# Altium schematic sheet 11.MIPI_CSI_RX.SchDoc: CM3 IO
size 297 x 209 mm; Page Create Date: March  8, 1995; Page Number: 11; Page Size: A4; Comment: radxa_1010; Page Count: 20; RevCode: 1.36; Doc: MIPI_CSI_RX; DsnPath: D:\WMS\黄工\[RC119]CM3_IO_V1.36\对外资料\radxa_cm3_io_board_v1360.DSN; SchematicName: CM3_IO V1.36; PageName: 11.MIPI_CSI_RX; PageSize: A4; TopSchematic: True
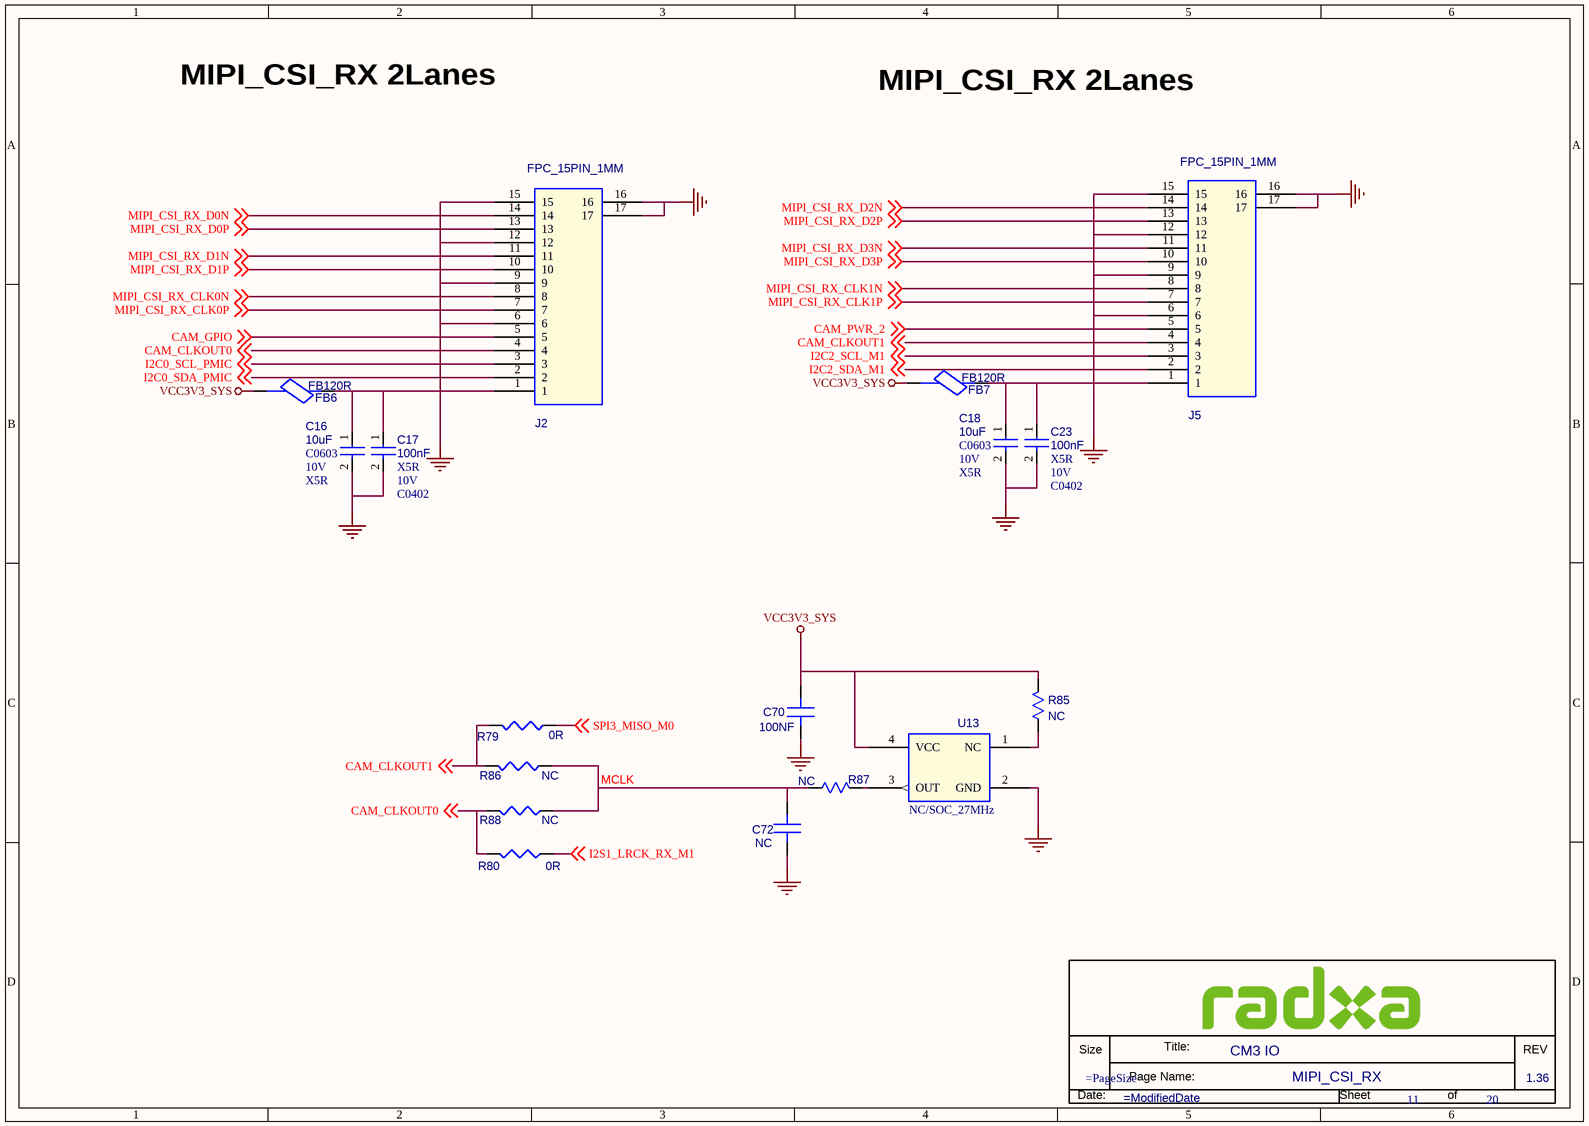
[diagram p0: 11.MIPI_CSI_RX.SchDoc]

## Parts
*  Doc: MIPI_CSI_RX  RevCode: 1.36  Title: CM3 IO  Page Number: 11  Page Count: 20  (hidden comment: radxa_1010)  (graphical)
C16  10uF  Voltage: 10V  Dielectric: X5R  [C0603]
C17  100nF  Voltage: 10V  Dielectric: X5R  [C0402]
C18  10uF  Voltage: 10V  Dielectric: X5R  [C0603]
C23  100nF  Voltage: 10V  Dielectric: X5R  [C0402]
C70  100NF  [C0402]
C72  NC  [C0402]
FB6  FB120R  [R0402]
FB7  FB120R  [R0402]
J2  FPC_15PIN_1MM  [FPC_15PIN_1MM]
J5  FPC_15PIN_1MM  [FPC_15PIN_1MM]
R79  0R  [R0402]
R80  0R  [R0402]
R85  NC  [R0402]
R86  NC  [R0402]
R87  NC  [R0402]
R88  NC  [R0402]
U13  NC/SOC_27MHz  [CRY4_3R20X2R50X0R80]

## Nets
GND: C16.2 C17.2 C18.2 C23.2 C70.2 C72.2 J2.6 J2.9 J2.12 J2.15 J2.16 J2.17 J5.6 J5.9 J5.12 J5.15 J5.16 J5.17 U13.2(GND)
VCC3V3_SYS: C70.1 FB6.1 FB7.1 R85.2 U13.4(VCC)
CAM_CLKOUT0: J2.4 R80.1 R88.2 ; off-sheet CAM_CLKOUT0
CAM_CLKOUT1: J5.4 R79.1 R86.2 ; off-sheet CAM_CLKOUT1
CAM_GPIO: J2.5 ; off-sheet CAM_GPIO
CAM_PWR_2: J5.5 ; off-sheet CAM_PWR_2
I2C0_SCL_PMIC: J2.3 ; off-sheet I2C0_SCL_PMIC
I2C0_SDA_PMIC: J2.2 ; off-sheet I2C0_SDA_PMIC
I2C2_SCL_M1: J5.3 ; off-sheet I2C2_SCL_M1
I2C2_SDA_M1: J5.2 ; off-sheet I2C2_SDA_M1
I2S1_LRCK_RX_M1: R80.2 ; off-sheet I2S1_LRCK_RX_M1
MCLK: C72.1 R86.1 R87.2 R88.1
MIPI_CSI_RX_CLK0N: J2.8 ; off-sheet MIPI_CSI_RX_CLK0N
MIPI_CSI_RX_CLK0P: J2.7 ; off-sheet MIPI_CSI_RX_CLK0P
MIPI_CSI_RX_CLK1N: J5.8 ; off-sheet MIPI_CSI_RX_CLK1N
MIPI_CSI_RX_CLK1P: J5.7 ; off-sheet MIPI_CSI_RX_CLK1P
MIPI_CSI_RX_D0N: J2.14 ; off-sheet MIPI_CSI_RX_D0N
MIPI_CSI_RX_D0P: J2.13 ; off-sheet MIPI_CSI_RX_D0P
MIPI_CSI_RX_D1N: J2.11 ; off-sheet MIPI_CSI_RX_D1N
MIPI_CSI_RX_D1P: J2.10 ; off-sheet MIPI_CSI_RX_D1P
MIPI_CSI_RX_D2N: J5.14 ; off-sheet MIPI_CSI_RX_D2N
MIPI_CSI_RX_D2P: J5.13 ; off-sheet MIPI_CSI_RX_D2P
MIPI_CSI_RX_D3N: J5.11 ; off-sheet MIPI_CSI_RX_D3N
MIPI_CSI_RX_D3P: J5.10 ; off-sheet MIPI_CSI_RX_D3P
SPI3_MISO_M0: R79.2 ; off-sheet SPI3_MISO_M0
NetC16_1: C16.1 C17.1 FB6.2 J2.1
NetC18_1: C18.1 C23.1 FB7.2 J5.1
NetR85_1: R85.1 U13.1(NC)
NetR87_1: R87.1 U13.3(OUT)

## Notes on the sheet
- MIPI_CSI_RX 2Lanes
- (in symbol radxa_1010) Title:; Size; REV; Page Name:; Date:; Sheet; of

## Library data of the parts
C16 = CAP NP: cap,10.00uF,+/-10%,10V,X5R,C0603; Part Reference: C16; Manufacturer PN: C1608X5R1A106K080AC; Manufacturer: TDK; Tolerance: 10%; Priority: A; PCB Footprint: C0603; Value: 10uF; Created by: JJJ; Part Type: C0603; RK PN: C1608X5R1A106K080AC
C17 = CAP NP: cap,100.00nF,+/-10%,10V,X5R,C0402; Part Reference: C17; Manufacturer: TDK; RK PN: C1005X5R1A104K050BA; Priority: A; Tolerance: 10%; PCB Footprint: C0402; Value: 100nF; Part Type: C0402; Manufacturer PN: C1005X5R1A104K050BA; Created by: JJJ
C18 = CAP NP: cap,10.00uF,+/-10%,10V,X5R,C0603; Part Reference: C18; Manufacturer PN: C1608X5R1A106K080AC; Manufacturer: TDK; Tolerance: 10%; Priority: A; PCB Footprint: C0603; Value: 10uF; Created by: JJJ; Part Type: C0603; RK PN: C1608X5R1A106K080AC
C23 = CAP NP: cap,100.00nF,+/-10%,10V,X5R,C0402; Part Reference: C23; Manufacturer: TDK; RK PN: C1005X5R1A104K050BA; Priority: A; Tolerance: 10%; PCB Footprint: C0402; Value: 100nF; Part Type: C0402; Manufacturer PN: C1005X5R1A104K050BA; Created by: JJJ
C70 = C: 贴片陶瓷电容 0402 X5R 1uF±10% 16V; PARTS: 1; Part Reference: C70; Part Number: 823030105005; OriginalSymbolOrigin: (0,30); PKG_TYPE: CAP2-100-250; LEVEL: STD; PINSWAP: (A,B); Approved: 已承认; Grade: B; ROOM: DVDD_MEDIA; Value: 100NF; Part Type: 电容; PCB Footprint: C0402
C72 = C: 贴片陶瓷电容 0402 NPO 10pF±5% 50V; PARTS: 1; Part Reference: C72; Part Number: 823060100001; OriginalSymbolOrigin: (0,30); PKG_TYPE: CAP2-100-250; LEVEL: STD; PINSWAP: (A,B); Approved: 已承认; Grade: B; ROOM: AN41908; Value: NC; Part Type: 电容; PCB Footprint: C0402
FB6 = FB: 贴片磁珠 0603 600Ω±25% 1000mA 铁氧体叠片 UPZ1608E601-1R0T 顺络; Part Reference: FB6; Part Number: 832026000003; Approved: 已承认; Grade: D; Value: FB120R; Part Type: 磁珠; PCB Footprint: R0402
FB7 = FB: 贴片磁珠 0603 600Ω±25% 1000mA 铁氧体叠片 UPZ1608E601-1R0T 顺络; Part Reference: FB7; Part Number: 832026000003; Approved: 已承认; Grade: D; Value: FB120R; Part Type: 磁珠; PCB Footprint: R0402
J2 = CON15_1: Part Reference: J2; Value: FPC_15PIN_1MM; PCB Footprint: FPC_15PIN_1MM
J5 = CON15_2: Part Reference: J5; Value: FPC_15PIN_1MM; PCB Footprint: FPC_15PIN_1MM
R79 = RESISTOR_0: 通用厚膜电阻,100R,+/-5%,R0402,1/16W.; Part Reference: R79; Manufacturer: YAGEO; RK PN: RC0402JR-07100RL; Priority: A; Tolerance: 5%; Wattage: 1/16W; Value: 0R; Part Type: 通用厚膜电阻; Manufacturer PN: RC0402JR-07100RL; Created by: YTL; PCB Footprint: R0402
R80 = RESISTOR_0: 通用厚膜电阻,100R,+/-5%,R0402,1/16W.; Part Reference: R80; Manufacturer: YAGEO; RK PN: RC0402JR-07100RL; Priority: A; Tolerance: 5%; Wattage: 1/16W; Value: 0R; Part Type: 通用厚膜电阻; Manufacturer PN: RC0402JR-07100RL; Created by: YTL; PCB Footprint: R0402
R85 = R: 贴片电阻 0805 0Ω±5%; PARTS: 1; Part Reference: R85; Part Number: 811040000001; LEVEL: STD; PKG_TYPE: 2; PINSWAP: (A,B); OriginalSymbolOrigin: (10,20); ROOM: DC-IRIS; Grade: B; Approved: 已承认; Value: NC; Part Type: 电阻; PCB Footprint: R0402
R86 = RESISTOR_0: 通用厚膜电阻,100R,+/-5%,R0402,1/16W.; Part Reference: R86; Manufacturer: YAGEO; RK PN: RC0402JR-07100RL; Priority: A; Tolerance: 5%; Wattage: 1/16W; Value: NC; Part Type: 通用厚膜电阻; Manufacturer PN: RC0402JR-07100RL; Created by: YTL; PCB Footprint: R0402
R87 = R: 贴片电阻 0402 33Ω±5%; PARTS: 1; Part Reference: R87; Part Number: 811020330001; LEVEL: STD; PKG_TYPE: 2; PINSWAP: (A,B); OriginalSymbolOrigin: (10,20); ROOM: AN41908; Grade: B; Approved: 已承认; Value: NC; Part Type: 电阻; PCB Footprint: R0402
R88 = RESISTOR_0: 通用厚膜电阻,100R,+/-5%,R0402,1/16W.; Part Reference: R88; Manufacturer PN: RC0402JR-07100RL; Manufacturer: YAGEO; Wattage: 1/16W; Tolerance: 5%; Priority: A; Value: NC; Created by: YTL; Part Type: 通用厚膜电阻; RK PN: RC0402JR-07100RL; PCB Footprint: R0402
U13 = OSC_4PIN_1: 贴片钟振 27.000MHz ±30PPM  3.3V 3.2x2.5mm; Part Reference: U13; Part Number: 841042700403; Grade: B; Approved: 已承认; ROOM: AN41908; Value: NC/SOC_27MHz; Part Type: 钟振; PCB Footprint: CRY4_3R20X2R50X0R80
* = radxa_1010: Page Create Date: March  8, 1995; Page Size: =PageSize; Page Modify Date: =ModifiedDate